# Altium schematic sheet MMU_LSD6D.SchDoc: MMU_LSD6D
size A4; DrawnBy: BossFish; Revision: Test/v0.2; SheetNumber: 4; SheetTotal: 4
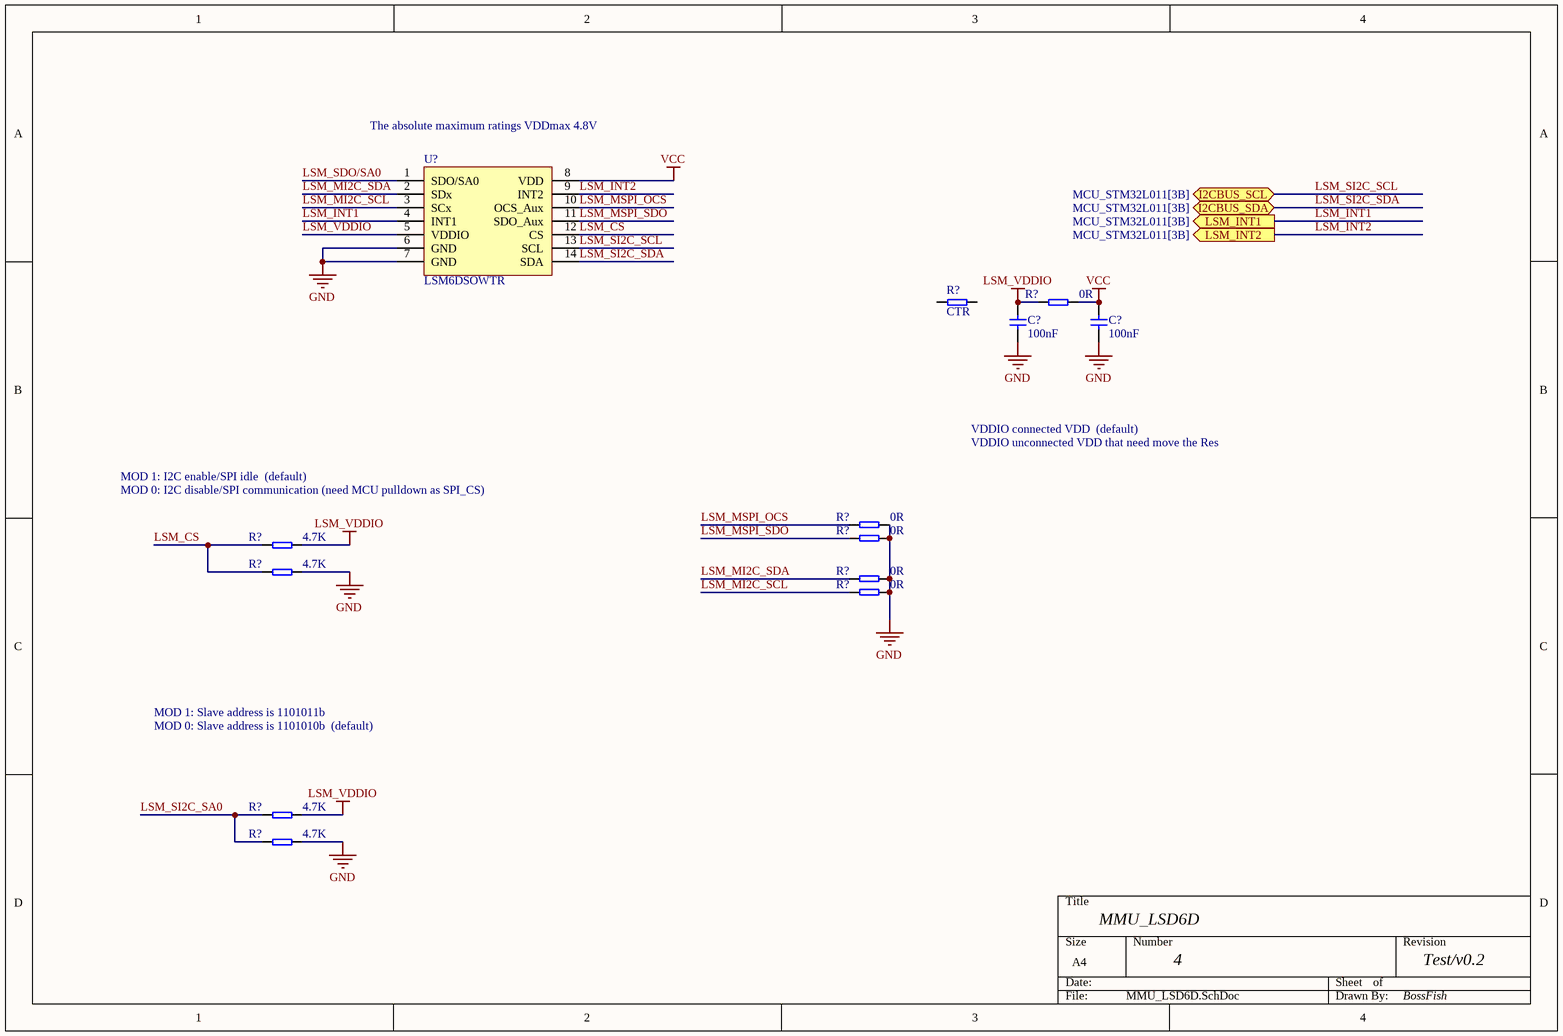
[diagram p0: MMU_LSD6D.SchDoc]

## Parts
(Parts that share a designator on the sheet are numbered #1, #2 ... from top to bottom, then left to right.)
C?#1  100nF  [0603-C]
C?#2  100nF  [0603-C]
R?#1  CTR  [0603-R]
R?#2  0R  [0603-R]
R?#3  0R  [0603-R]
R?#4  0R  [0603-R]
R?#5  4.7K  [0603-R]
R?#6  4.7K  [0603-R]
R?#7  0R  [0603-R]
R?#8  0R  [0603-R]
R?#9  4.7K  [0603-R]
R?#10  4.7K  [0603-R]
U?  LSM6DSOWTR  [LGA-14L(2.5x3.0)]

## Ports
I2CBUS_SCL (bidir, see MCU_STM32L011[3B]), I2CBUS_SDA (bidir, see MCU_STM32L011[3B]), LSM_INT1 (out, see MCU_STM32L011[3B]), LSM_INT2 (out, see MCU_STM32L011[3B])

## Nets
GND: C?#1.1 C?#2.1 R?#3.2 R?#4.2 R?#6.2 R?#7.2 R?#8.2 R?#10.2 U?.6(GND) U?.7(GND)
LSM_VDDIO: C?#1.2 R?#2.1 R?#5.2 R?#9.2 U?.5(VDDIO)
VCC: C?#2.2 R?#2.2 U?.8(VDD)
LSM_CS: R?#5.1 R?#6.1 U?.12(CS)
LSM_INT1: U?.4(INT1) ; port LSM_INT1
LSM_INT2: U?.9(INT2) ; port LSM_INT2
LSM_MI2C_SCL: R?#8.1 U?.3(SCx)
LSM_MI2C_SDA: R?#7.1 U?.2(SDx)
LSM_MSPI_OCS: R?#3.1 U?.10(OCS_Aux)
LSM_MSPI_SDO: R?#4.1 U?.11(SDO_Aux)
LSM_SDO/SA0: U?.1(SDO/SA0)
LSM_SI2C_SA0: R?#9.1 R?#10.1
LSM_SI2C_SCL: U?.13(SCL) ; port I2CBUS_SCL
LSM_SI2C_SDA: U?.14(SDA) ; port I2CBUS_SDA

Not connected (* = marked no-connect by the designer): R?#1 1 2

## Notes on the sheet
- (near U?) The absolute maximum ratings VDDmax 4.8V
- VDDIO connected VDD  (default)
- VDDIO unconnected VDD that need move the Res
- MOD 1: I2C enable/SPI idle  (default)
- (near R?#5) MOD 0: I2C disable/SPI communication (need MCU pulldown as SPI_CS)
- MOD 1: Slave address is 1101011b
- MOD 0: Slave address is 1101010b  (default)

## Library data of the parts
C?#1 C?#2 = Cap
R?#1-R?#10 = Res
U? = LSM6DSOWTR: 6-axis IMU (inertial measurement unit): / always-on 3‑axis accelerometer and 3‑axis gyroscop